# Altium project VCU 3.0.PrjPcb
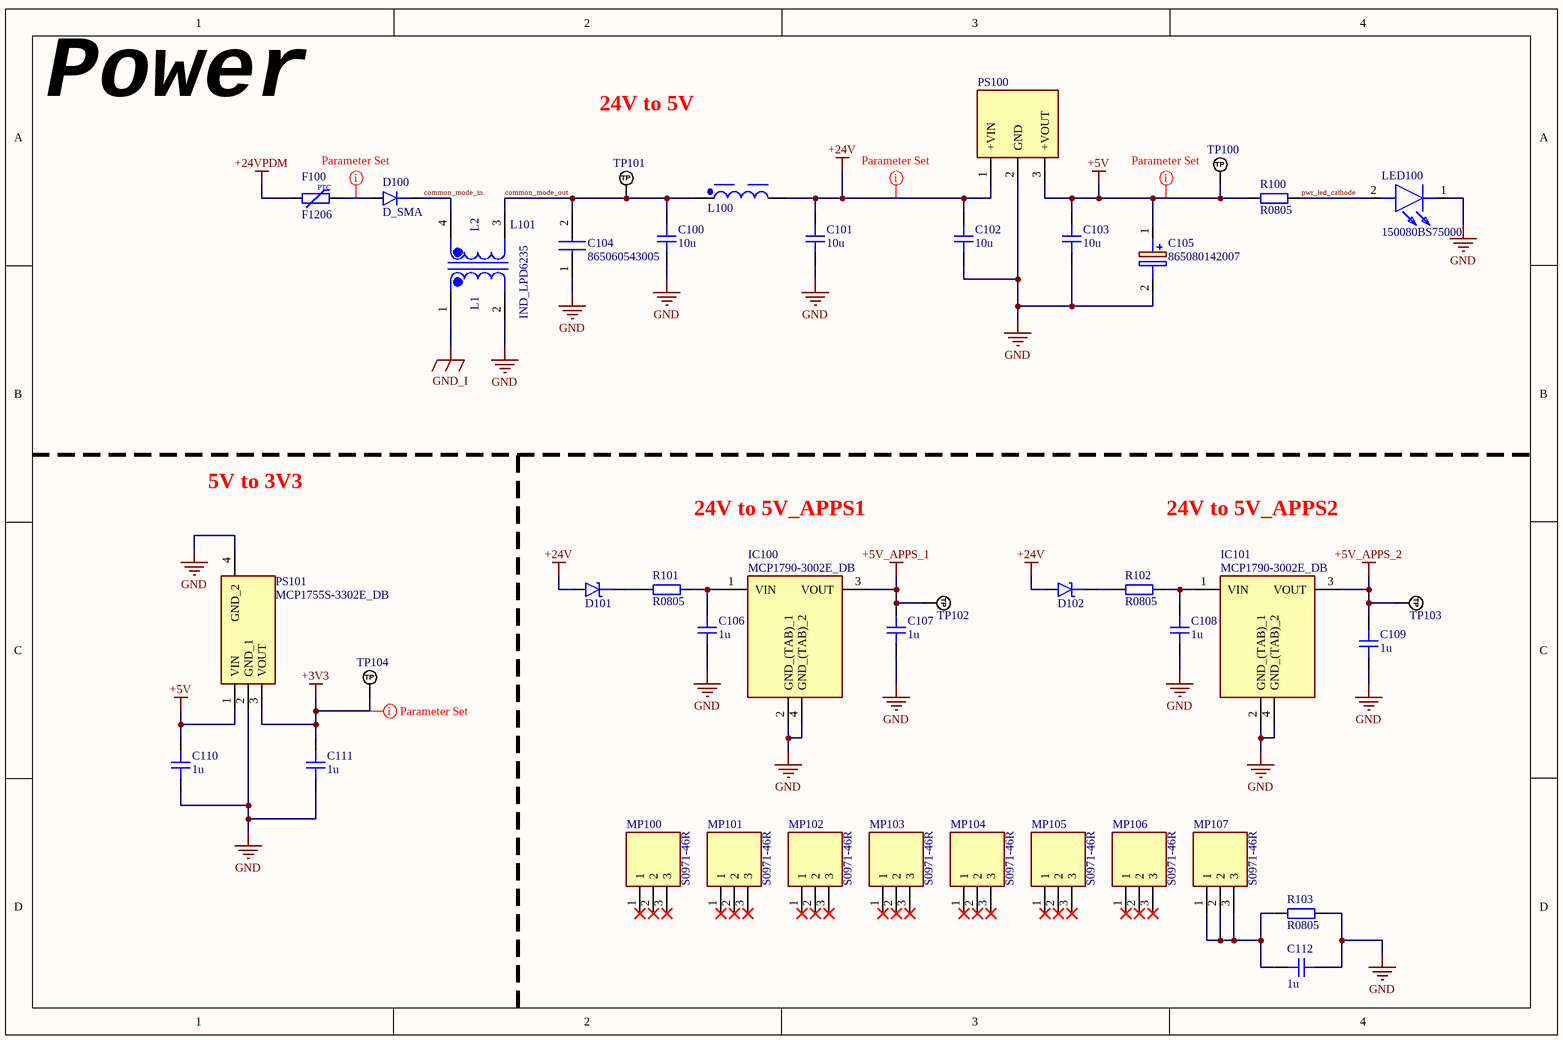
[diagram p0: POWER.SchDoc]
6 sheets, 199 parts. Net scope: global (net labels, ports and power ports of the same name join across sheets).
Board file: PCB_VCU3.0.PcbDoc
Sheets:
  POWER.SchDoc
  PIC32.SchDoc
  CAN.SchDoc
  APPS.SchDoc
  OUTPUT.SchDoc
  MOSFETS.SchDoc

## Sheet POWER.SchDoc
size A4; SheetNumber: 1; SheetTotal: 6; SPICEModelCacheUVDKUZOY: <root> / <DocumentId>UVDKUZOY</DocumentId> / <CacheFrame Number="0"> / <Model Name="1280_74477005_5.6u" Kind="CKT"> / <Text>******* / .subckt 1280_74477005_5.6u 1 2 / Rp 1 2 5511 / Cp 1 2 8p / Rs 1 N3 0.0105 / L1 N3 2 5.464u / .ends 1280_74477005_5.6u</Text> / </Model> / </CacheFrame> / </root>

### Parts
C100  10u  [CAP_0805]
C101  10u  [CAP_0805]
C102  10u  [CAP_0805]
C103  10u  [CAP_0805]
C104  865060543005  [865060543005]
C105  865080142007  [CAPAE530X550N]
C106  1u  [CAP_0805]
C107  1u  [CAP_0805]
C108  1u  [CAP_0805]
C109  1u  [CAP_0805]
C110  1u  [CAP_0805]
C111  1u  [CAP_0805]
C112  1u  [CAP_0805]
D100  D_SMA  [DO-214AC-2 (SMA)]
D101  D_SCHOTTKY_SOD_323  [SOD-323]  (value not drawn)
D102  D_SCHOTTKY_SOD_323  [SOD-323]  (value not drawn)
F100  F1206  [FUSE_1206]
IC100  MCP1790-3002E_DB  [SOT230P700X180-4N]
IC101  MCP1790-3002E_DB  [SOT230P700X180-4N]
L100  5.6uH, 8.7A  [WE-PD_1280]  (value not drawn)
L101  IND_LPD6235  [IND_LPD6235]
LED100  150080BS75000  [LEDC2012X80N]
MP100  S0971-46R  [S097146R]
MP101  S0971-46R  [S097146R]
MP102  S0971-46R  [S097146R]
MP103  S0971-46R  [S097146R]
MP104  S0971-46R  [S097146R]
MP105  S0971-46R  [S097146R]
MP106  S0971-46R  [S097146R]
MP107  S0971-46R  [S097146R]
PS100  R-78E5.0-0.5  [R78E5005]  (value not drawn)
PS101  MCP1755S-3302E_DB  [SOT230P700X180-4N]
R100  R0805  [RES_0805]
R101  R0805  [RES_0805]
R102  R0805  [RES_0805]
R103  R0805  [RES_0805]
TP100  TP_NOBOM  [PAD_RND_1MM]  (value not drawn)  (no BOM)
TP101  TP_NOBOM  [PAD_RND_1MM]  (value not drawn)  (no BOM)
TP102  TP_NOBOM  [PAD_RND_1MM]  (value not drawn)  (no BOM)
TP103  TP_NOBOM  [PAD_RND_1MM]  (value not drawn)  (no BOM)
TP104  TP_NOBOM  [PAD_RND_1MM]  (value not drawn)  (no BOM)

### Nets
+3V3: C111.1 PS101.3(VOUT) TP104.1(TP)
+5V: C103.2 C105.1(+) C110.1 PS100.3(+VOUT) PS101.1(VIN) R100.1 TP100.1(TP)
+5V_APPS_1: C107.1 IC100.3(VOUT) TP102.1(TP)
+5V_APPS_2: C109.1 IC101.3(VOUT) TP103.1(TP)
+24V: C101.2 C102.2 D101.A D102.A L100.2 PS100.1(+VIN)
+24VPDM: F100.1
GND: C100.1 C101.1 C102.1 C103.1 C104.1(+) C105.2(-) C106.2 C107.2 C108.2 C109.2 C110.2 C111.2 C112.2 IC100.2(GND_(TAB)_1) IC100.4(GND_(TAB)_2) IC101.2(GND_(TAB)_1) IC101.4(GND_(TAB)_2) L101.2 LED100.1(K) PS100.2(GND) PS101.2(GND_1) PS101.4(GND_2) R103.1
GND_I: L101.1
common_mode_in: D100.K L101.4
common_mode_out: C100.2 C104.2(-) L100.1 L101.3 TP101.1(TP)
pwr_led_cathode: LED100.2(A) R100.2
NetC106_1: C106.1 IC100.1(VIN) R101.1
NetC108_1: C108.1 IC101.1(VIN) R102.1
NetC112_1: C112.1 MP107.1 MP107.2 MP107.3 R103.2
NetD100_A: D100.A F100.2
NetD101_K: D101.K R101.2
NetD102_K: D102.K R102.2

Not connected (* = marked no-connect by the designer): MP100 1* 2* 3*; MP101 1* 2* 3*; MP102 1* 2* 3*; MP103 1* 2* 3*; MP104 1* 2* 3*; MP105 1* 2* 3*; MP106 1* 2* 3*

### Layout directives
net class POWER: +3V3, +5V, +24V, NetD100_A

### Notes on the sheet
- Power
- 24V to 5V
- 5V to 3V3
- 24V to 5V_APPS1
- 24V to 5V_APPS2
- (in symbol FUSE_PPTC_1206) PTC
- (in symbol IND_LPD6235) L2; L1

### Library data of the parts
C100-C103 C106-C112 = CAP_0805_10V: Capacitor SMD 0805 10V
C104 = 865060543005: Capacitor; Manufacturer_Name: Wurth Elektronik; Datasheet Link: https://componentsearchengine.com/Datasheets/1/865060543005.pdf; Height: 5.5mm; Manufacturer_Part_Number: 865060543005; Mouser Part Number: 710-865060543005; Mouser Price/Stock: https://www.mouser.co.uk/ProductDetail/Wurth-Elektronik/865060543005?qs=0KOYDY2FL29pKd1yRWsrOw%3D%3D
C105 = 865080142007: Capacitor Polarised; Manufacturer_Name: Wurth Elektronik; Datasheet Link: https://katalog.we-online.com/pbs/datasheet/865080142007.pdf; Height: 5.5mm; Manufacturer_Part_Number: 865080142007; Mouser Part Number: 710-865080142007; Mouser Price/Stock: https://www.mouser.co.uk/ProductDetail/Wurth-Elektronik/865080142007?qs=0KOYDY2FL2%2Fwso3YmuIP2w%3D%3D
D100 = D_SMA: Diode SMD SMA (DO-214AA)
D101 D102 = D_SCHOTTKY_SOD_323: Diode Schottky SMD SOD-323
F100 = FUSE_PPTC_1206: Fuse PPTC SMD 1206; Manufacturer: *; Manufacturer Part Number: *
IC100 IC101 = MCP1790-3002E_DB: Integrated Circuit; Manufacturer_Name: Microchip; Manufacturer_Part_Number: MCP1790-3002E/DB; Datasheet Link: http://ww1.microchip.com/downloads/en/DeviceDoc/22075b.pdf; Height: 1.8mm; Mouser Part Number: 579-MCP1790-3002E/DB; Mouser Price/Stock: https://www.mouser.co.uk/ProductDetail/Microchip-Technology/MCP1790-3002E-DB?qs=gsqZ4L1luKroJ%252BBibcYbpw%3D%3D; Arrow Part Number: MCP1790-3002E/DB; Arrow Price/Stock: https://www.arrow.com/en/products/mcp1790-3002edb/microchip-technology?region=nac
L100 = 74477005: WE-PD SMT Power Inductor, size 1280, 5.6uH, 8.7A, 13.5mOhm; Manufacturer: Wurth Elektronik; Case/Size Code: 1280; DC Resistance: 10.5mOhm; Saturation Current: 10A; Self Resonant Frequency: 24MHz; Type: Standard; Manufacturer Part Number: 74477005; Category: Power Inductors; Match Code: WE-PD; ComponentLink1Description: Website Link; ComponentLink1URL: https://www.we-online.com/redexpert/article/74477005?ad; ComponentLink2Description: Datasheet Link; ComponentLink2URL: https://www.we-online.com/redexpert/spec/74477005?ad; Mount: Surface Mount; Operating Temperature Max: 125°C; Operating Temperature Min: -40°C; Packaging: Tape and Reel; Length: 12mm; Width: 12mm; Height: 8mm; DC Resistance Max: 13.5mOhm; Inductance: 5.6uH; Rated Current: 8.7A
LED100 = 150080BS75000: LED; Manufacturer_Name: Wurth Elektronik; Datasheet Link: https://katalog.we-online.com/led/datasheet/150080BS75000.pdf; Height: 0.8mm; Manufacturer_Part_Number: 150080BS75000; Mouser Part Number: 710-150080BS75000; Mouser Price/Stock: https://www.mouser.co.uk/ProductDetail/Wurth-Elektronik/150080BS75000?qs=2kOmHSv6VfT2tBo3UPVqAQ%3D%3D
MP100-MP107 = S0971-46R: Mechanical Part; Manufacturer_Name: Harwin; Datasheet Link: https://cdn.harwin.com/pdfs/S0971-46R.pdf; Height: 2.1mm; Manufacturer_Part_Number: S0971-46R; Mouser Part Number: 855-S0971-46R; Mouser Price/Stock: https://www.mouser.co.uk/ProductDetail/Harwin/S0971-46R?qs=AXRVZpzixL%252Bly5Y74siI1Q%3D%3D
PS100 = R-78E5.0-0.5: Power Supply; Manufacturer_Name: RECOM Power; Datasheet Link: https://datasheet.datasheetarchive.com/originals/distributors/Datasheets_SAMA/1560217c2d38d5ce10907af13420fc49.pdf; Height: 10.9mm; Manufacturer_Part_Number: R-78E5.0-0.5; Mouser Part Number: 919-R-78E5.0-0.5; Mouser Price/Stock: https://www.mouser.co.uk/ProductDetail/RECOM-Power/R-78E5.0-0.5?qs=JeAkOuORR2UvBuiB2kZVZQ%3D%3D; Arrow Part Number: R-78E5.0-0.5; Arrow Price/Stock: https://www.arrow.com/en/products/r-78e5.0-0.5/recom-power?region=europe
PS101 = MCP1755S-3302E_DB: Power Supply; Manufacturer_Name: Microchip; Manufacturer_Part_Number: MCP1755S-3302E/DB; Datasheet Link: http://www.farnell.com/datasheets/1697992.pdf; Height: 1.8mm; Mouser Part Number: 579-MCP1755S-3302EDB; Mouser Price/Stock: https://www.mouser.co.uk/ProductDetail/Microchip-Technology/MCP1755S-3302E-DB?qs=OCR3PNzn1cc7Hxpx9CIZgA%3D%3D; Arrow Part Number: MCP1755S-3302E/DB; Arrow Price/Stock: https://www.arrow.com/en/products/mcp1755s-3302edb/microchip-technology?region=nac
R100-R103 = RES_0805: Resistor SMD 0805; Manufacturer: *; Manufacturer Part Number: *; Distributor Link: *; LCSC: *
TP100-TP104 = TEST_POINT_RND_1MM: Test Point Round 1mm (NO BOM)

## Sheet PIC32.SchDoc
size A2; SheetNumber: 2; SheetTotal: 6
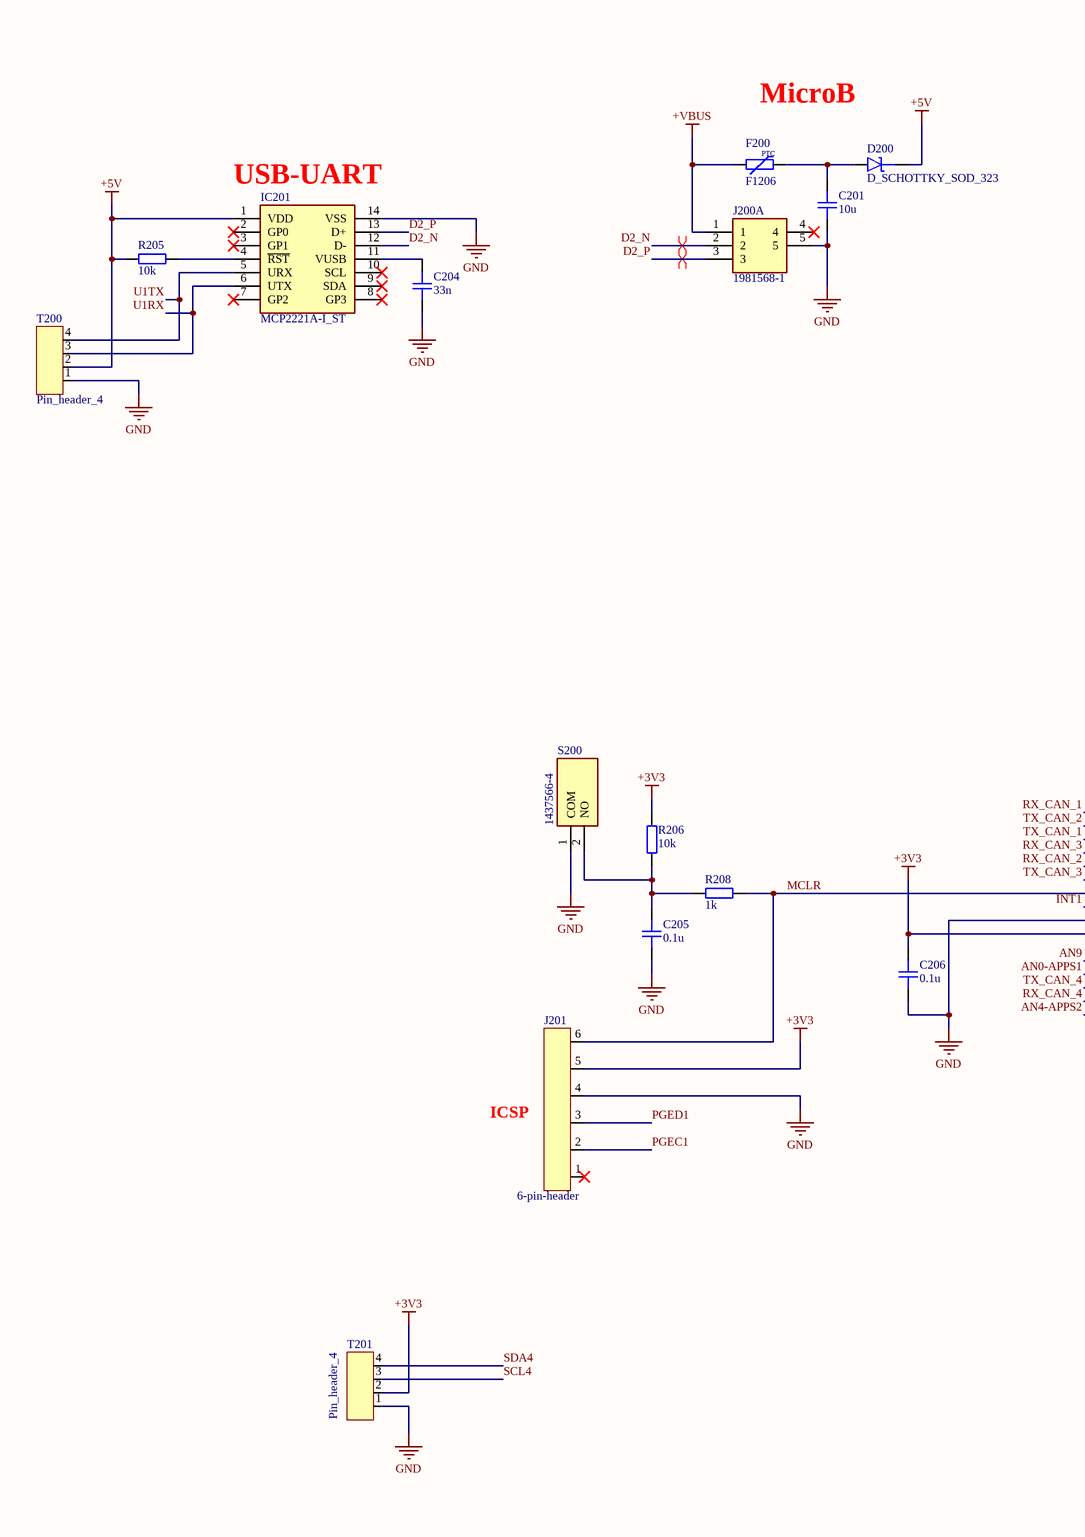
[diagram p1: PIC32.SchDoc, left]
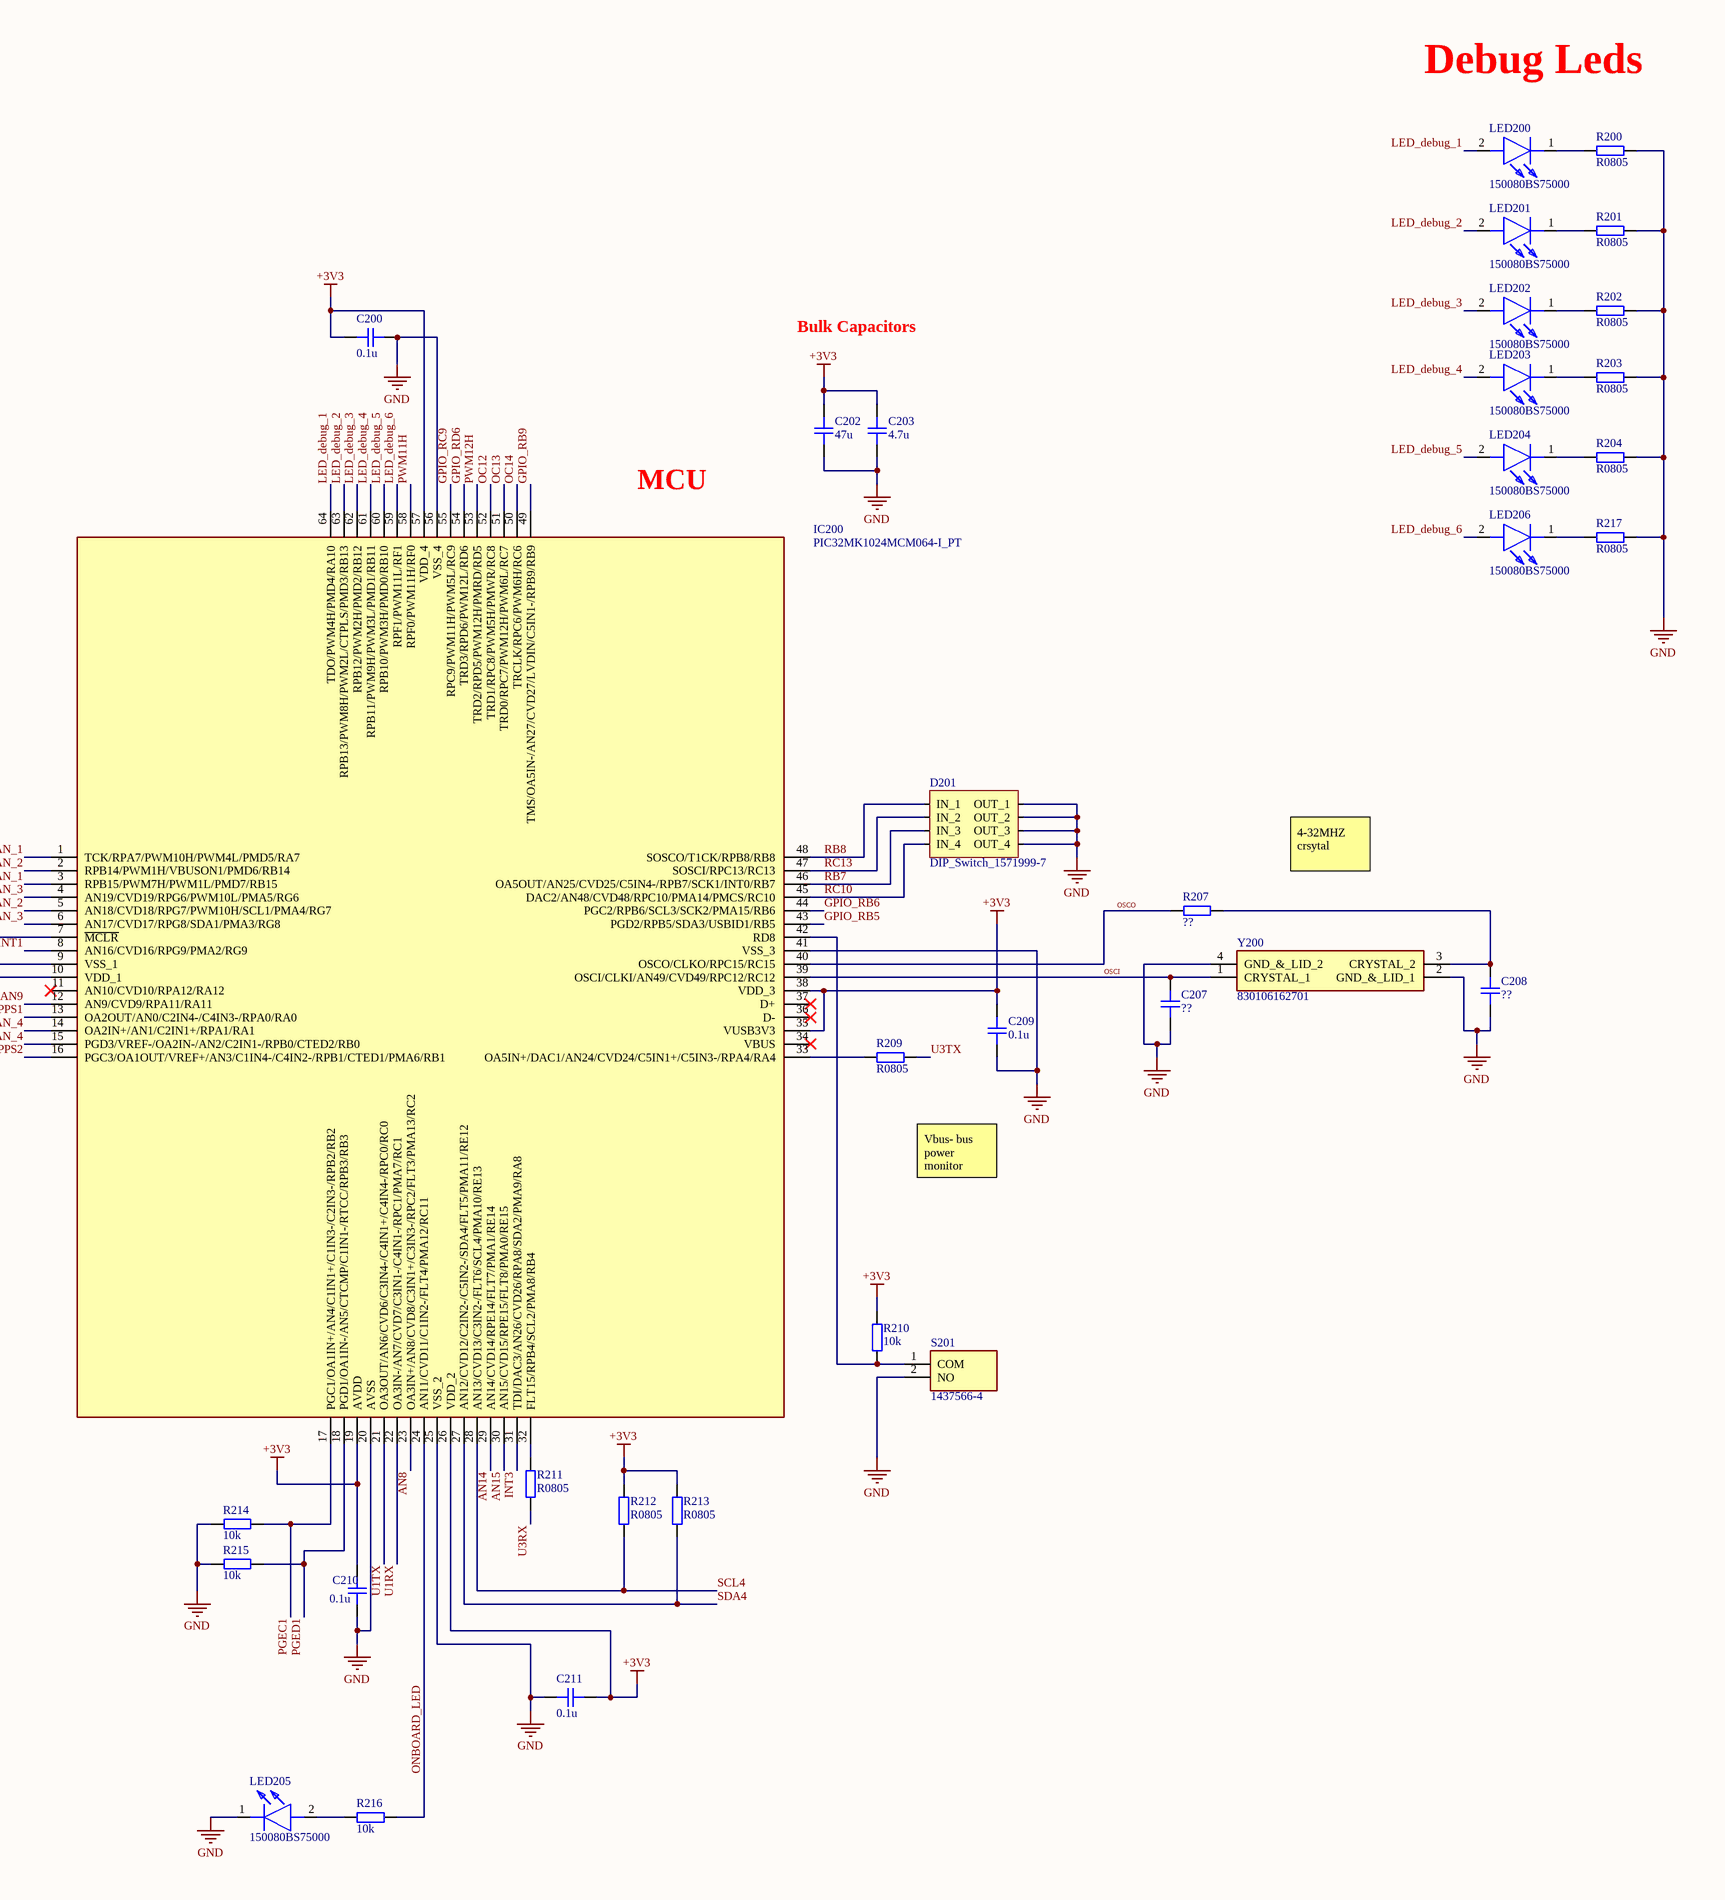
[diagram p2: PIC32.SchDoc, right]

### Parts
C200  0.1u  [CAP_0805]
C201  10u  [CAP_0805]
C202  47u  [CAP_0805]
C203  4.7u  [CAP_0805]
C204  33n  [CAP_0805]
C205  0.1u  [CAP_0805]
C206  0.1u  [CAP_0805]
C207  ??  [CAP_0805]
C208  ??  [CAP_0805]
C209  0.1u  [CAP_0805]
C210  0.1u  [CAP_0805]
C211  0.1u  [CAP_0805]
D200  D_SCHOTTKY_SOD_323  [SOD-323]
D201  DIP_Switch_1571999-7  [DIP_Switch_1571999-7 - duplicate]
F200  F1206  [FUSE_1206]
IC200  PIC32MK1024MCM064-I_PT  [QFP50P1200X1200X120-64N]
IC201  MCP2221A-I_ST  [SOP65P640X120-14N]
J200  1981568-1  [1981568-1]  (part A of 4)
J201  6-pin-header  [G800W302018EU]
LED200  150080BS75000  [LEDC2012X80N]
LED201  150080BS75000  [LEDC2012X80N]
LED202  150080BS75000  [LEDC2012X80N]
LED203  150080BS75000  [LEDC2012X80N]
LED204  150080BS75000  [LEDC2012X80N]
LED205  150080BS75000  [LEDC2012X80N]
LED206  150080BS75000  [LEDC2012X80N]
R200  R0805  [RES_0805]
R201  R0805  [RES_0805]
R202  R0805  [RES_0805]
R203  R0805  [RES_0805]
R204  R0805  [RES_0805]
R205  10k  [RES_0805]
R206  10k  [RES_0805]
R207  ??  [RES_0805]
R208  1k  [RES_0805]
R209  R0805  [RES_0805]
R210  10k  [RES_0805]
R211  R0805  [RES_0805]
R212  R0805  [RES_0805]
R213  R0805  [RES_0805]
R214  10k  [RES_0805]
R215  10k  [RES_0805]
R216  10k  [RES_0805]
R217  R0805  [RES_0805]
S200  1437566-4  [14375664]
S201  1437566-4  [14375664]
T200  Pin_header_4  [Pin_header_4]
T201  Pin_header_4  [Pin_header_4]
Y200  830106162701  [830106162701]

### Nets
+3V3: C200.1 C202.1 C203.1 C206.2 C209.1 C210.2 C211.1 IC200.10(VDD_1) IC200.19(AVDD) IC200.26(VDD_2) IC200.35(VUSB3V3) IC200.38(VDD_3) IC200.57(VDD_4) J201.5 R206.1 R210.2 R212.1 R213.1 T201.2
+5V: D200.K IC201.1(VDD) R205.1 T200.2
+VBUS: F200.1 J200.1
GND: C200.2 C201.2 C202.2 C203.2 C204.1 C205.1 C206.1 C207.1 C208.1 C209.2 C210.1 C211.2 D201.5(OUT_4) D201.6(OUT_3) D201.7(OUT_2) D201.8(OUT_1) IC200.9(VSS_1) IC200.20(AVSS) IC200.25(VSS_2) IC200.41(VSS_3) IC200.56(VSS_4) IC201.14(VSS) J200.5 J201.4 LED205.1(K) R200.1 R201.1 R202.1 R203.1 R204.1 R214.2 R215.2 R217.1 S200.1(COM) S201.2(NO) T200.1 T201.1 Y200.2(GND_&_LID_1) Y200.4(GND_&_LID_2)
AN0-APPS1: IC200.13(OA2OUT/AN0/C2IN4-/C4IN3-/RPA0/RA0)
AN4-APPS2: IC200.16(PGC3/OA1OUT/VREF+/AN3/C1IN4-/C4IN2-/RPB1/CTED1/PMA6/RB1)
AN8: IC200.23(OA3IN+/AN8/CVD8/C3IN1+/C3IN3-/RPC2/FLT3/PMA13/RC2)
AN9: IC200.12(AN9/CVD9/RPA11/RA11)
AN14: IC200.29(AN14/CVD14/RPE14/FLT7/PMA1/RE14)
AN15: IC200.30(AN15/CVD15/RPE15/FLT8/PMA0/RE15)
D2_N: IC201.12(D-) J200.2
D2_P: IC201.13(D+) J200.3
GPIO_RB5: IC200.43(PGD2/RPB5/SDA3/USBID1/RB5)
GPIO_RB6: IC200.44(PGC2/RPB6/SCL3/SCK2/PMA15/RB6)
GPIO_RB9: IC200.49(TMS/OA5IN-/AN27/CVD27/LVDIN/C5IN1-/RPB9/RB9)
GPIO_RC9: IC200.55(RPC9/PWM11H/PWM5L/RC9)
GPIO_RD6: IC200.54(TRD3/RPD6/PWM12L/RD6)
INT1: IC200.8(AN16/CVD16/RPG9/PMA2/RG9)
INT3: IC200.31(TDI/DAC3/AN26/CVD26/RPA8/SDA2/PMA9/RA8)
LED_debug_1: IC200.64(TDO/PWM4H/PMD4/RA10) LED200.2(A)
LED_debug_2: IC200.63(RPB13/PWM8H/PWM2L/CTPLS/PMD3/RB13) LED201.2(A)
LED_debug_3: IC200.62(RPB12/PWM2H/PMD2/RB12) LED202.2(A)
LED_debug_4: IC200.61(RPB11/PWM9H/PWM3L/PMD1/RB11) LED203.2(A)
LED_debug_5: IC200.60(RPB10/PWM3H/PMD0/RB10) LED204.2(A)
LED_debug_6: IC200.59(RPF1/PWM11L/RF1) LED206.2(A)
MCLR: IC200.7(~{MCLR}) J201.6 R208.1
OC12: IC200.52(TRD1/RPC8/PWM5H/PMWR/RC8)
OC13: IC200.51(TRD0/RPC7/PWM12H/PWM6L/RC7)
OC14: IC200.50(TRCLK/RPC6/PWM6H/RC6)
ONBOARD_LED: IC200.24(AN11/CVD11/C1IN2-/FLT4/PMA12/RC11) R216.1
OSCI: C207.2 IC200.39(OSCI/CLKI/AN49/CVD49/RPC12/RC12) Y200.1(CRYSTAL_1)
OSCO: IC200.40(OSCO/CLKO/RPC15/RC15) R207.2
PGEC1: IC200.17(PGC1/OA1IN+/AN4/C1IN1+/C1IN3-/C2IN3-/RPB2/RB2) J201.2 R214.1
PGED1: IC200.18(PGD1/OA1IN-/AN5/CTCMP/C1IN1-/RTCC/RPB3/RB3) J201.3 R215.1
PWM11H: IC200.58(RPF0/PWM11H/RF0)
PWM12H: IC200.53(TRD2/RPD5/PWM12H/PMRD/RD5)
RB7: D201.3(IN_3) IC200.46(OA5OUT/AN25/CVD25/C5IN4-/RPB7/SCK1/INT0/RB7)
RB8: D201.1(IN_1) IC200.48(SOSCO/T1CK/RPB8/RB8)
RC10: D201.4(IN_4) IC200.45(DAC2/AN48/CVD48/RPC10/PMA14/PMCS/RC10)
RC13: D201.2(IN_2) IC200.47(SOSCI/RPC13/RC13)
RX_CAN_1: IC200.1(TCK/RPA7/PWM10H/PWM4L/PMD5/RA7)
RX_CAN_2: IC200.5(AN18/CVD18/RPG7/PWM10H/SCL1/PMA4/RG7)
RX_CAN_3: IC200.4(AN19/CVD19/RPG6/PWM10L/PMA5/RG6)
RX_CAN_4: IC200.15(PGD3/VREF-/OA2IN-/AN2/C2IN1-/RPB0/CTED2/RB0)
SCL4: IC200.28(AN13/CVD13/C3IN2-/FLT6/SCL4/PMA10/RE13) R212.2 T201.3
SDA4: IC200.27(AN12/CVD12/C2IN2-/C5IN2-/SDA4/FLT5/PMA11/RE12) R213.2 T201.4
TX_CAN_1: IC200.3(RPB15/PWM7H/PWM1L/PMD7/RB15)
TX_CAN_2: IC200.2(RPB14/PWM1H/VBUSON1/PMD6/RB14)
TX_CAN_3: IC200.6(AN17/CVD17/RPG8/SDA1/PMA3/RG8)
TX_CAN_4: IC200.14(OA2IN+/AN1/C2IN1+/RPA1/RA1)
U1RX: IC200.22(OA3IN-/AN7/CVD7/C3IN1-/C4IN1-/RPC1/PMA7/RC1) IC201.6(UTX) T200.3
U1TX: IC200.21(OA3OUT/AN6/CVD6/C3IN4-/C4IN1+/C4IN4-/RPC0/RC0) IC201.5(URX) T200.4
U3RX: R211.2
U3TX: R209.2
NetC201_1: C201.1 D200.A F200.2
NetC204_2: C204.2 IC201.11(VUSB)
NetC205_2: C205.2 R206.2 R208.2 S200.2(NO)
NetC208_2: C208.2 R207.1 Y200.3(CRYSTAL_2)
NetIC200_32: IC200.32(FLT15/RPB4/SCL2/PMA8/RB4) R211.1
NetIC200_33: IC200.33(OA5IN+/DAC1/AN24/CVD24/C5IN1+/C5IN3-/RPA4/RA4) R209.1
NetIC200_42: IC200.42(RD8) R210.1 S201.1(COM)
NetIC201_4: IC201.4(~{RST}) R205.2
NetLED200_1: LED200.1(K) R200.2
NetLED201_1: LED201.1(K) R201.2
NetLED202_1: LED202.1(K) R202.2
NetLED203_1: LED203.1(K) R203.2
NetLED204_1: LED204.1(K) R204.2
NetLED205_2: LED205.2(A) R216.2
NetLED206_1: LED206.1(K) R217.2

Not connected (* = marked no-connect by the designer): IC200 11(AN10/CVD10/RPA12/RA12)* 34(VBUS)* 36(D-)* 37(D+)*; IC201 2(GP0)* 3(GP1)* 7(GP2)* 8(GP3)* 9(SDA)* 10(SCL)*; J200 4*; J201 1*

### Layout directives
differential pair; net class DIFF_USB: D2_N, D2_P

### Notes on the sheet
- Debug Leds
- MicroB
- (near IC201) USB-UART
- Bulk Capacitors
- (near IC200) MCU
- 4-32MHZ crsytal
- (near J201) ICSP
- Vbus- bus power monitor
- (in symbol FUSE_PPTC_1206) PTC

### Library data of the parts
C200 C202 C203 C205-C211 = CAP_0805_16V: Capacitor SMD 0805 16V
C201 C204 = CAP_0805_10V: Capacitor SMD 0805 10V
D200 = D_SCHOTTKY_SOD_323: Diode Schottky SMD SOD-323
F200 = FUSE_PPTC_1206: Fuse PPTC SMD 1206; Manufacturer: *; Manufacturer Part Number: *
IC200 = PIC32MK1024MCM064-I_PT: Integrated Circuit; Manufacturer_Name: Microchip; Manufacturer_Part_Number: PIC32MK1024MCM064-I/PT; Datasheet Link: https://ww1.microchip.com/downloads/aemDocuments/documents/MCU32/ProductDocuments/DataSheets/PIC32MK-GPK-MCM-with-CAN-FD-Family-DataSheet-DS60001519E.pdf; Height: 1.2mm; Mouser Part Number: 579-2MK1024MCM064IPT; Mouser Price/Stock: https://www.mouser.co.uk/ProductDetail/Microchip-Technology/PIC32MK1024MCM064-I-PT?qs=W%2FMpXkg%252BdQ4dBI32NJdQMg%3D%3D; Arrow Part Number: PIC32MK1024MCM064-I/PT; Arrow Price/Stock: https://www.arrow.com/en/products/pic32mk1024mcm064-ipt/microchip-technology?region=nac
IC201 = MCP2221A-I_ST: Integrated Circuit; Manufacturer_Name: Microchip; Manufacturer_Part_Number: MCP2221A-I/ST; Datasheet Link: http://ww1.microchip.com/downloads/en/devicedoc/20005565b.pdf; Height: 1.2mm; Mouser Part Number: 579-MCP2221A-I/ST; Mouser Price/Stock: https://www.mouser.co.uk/ProductDetail/Microchip-Technology/MCP2221A-I-ST?qs=ZEMkBHnybREMkqMgzOrcGQ%3D%3D; Arrow Part Number: MCP2221A-I/ST; Arrow Price/Stock: https://www.arrow.com/en/products/mcp2221a-ist/microchip-technology?region=nac
J200 = 1981568-1: Connector; Manufacturer_Name: TE Connectivity; Datasheet Link: http://www.te.com/commerce/DocumentDelivery/DDEController?Action=srchrtrv&DocNm=1981568&DocType=Customer+Drawing&DocLang=English; Manufacturer_Part_Number: 1981568-1; Mouser Part Number: 571-1981568-1; Mouser Price/Stock: https://www.mouser.co.uk/ProductDetail/TE-Connectivity/1981568-1?qs=zxTme0yW%2FbaAfvOKTKC5hw%3D%3D; Arrow Part Number: 1981568-1; Arrow Price/Stock: https://www.arrow.com/en/products/1981568-1/te-connectivity?region=europe
J201 = G800W302018EU: Pin Header 6 Position 2.54mm Pitch; Manufacturer: Amphenol; Manufacturer Part Number: G800W302018EU
LED200-LED206 = 150080BS75000: LED; Manufacturer_Name: Wurth Elektronik; Datasheet Link: https://katalog.we-online.com/led/datasheet/150080BS75000.pdf; Height: 0.8mm; Manufacturer_Part_Number: 150080BS75000; Mouser Part Number: 710-150080BS75000; Mouser Price/Stock: https://www.mouser.co.uk/ProductDetail/Wurth-Elektronik/150080BS75000?qs=2kOmHSv6VfT2tBo3UPVqAQ%3D%3D
R200-R217 = RES_0805: Resistor SMD 0805
  R200-R204 R209 R211-R213 R217: Manufacturer: *; Manufacturer Part Number: *; Distributor Link: *; LCSC: *
S200 S201 = 1437566-4: Switch; Manufacturer_Name: TE Connectivity; Datasheet Link: https://www.te.com/commerce/DocumentDelivery/DDEController?Action=showdoc&DocId=Customer+Drawing%7F1437566-3%7FC2%7Fpdf%7FEnglish%7FENG_CD_1437566-3_C7F14375662_1437566_3_1_c.dwg.pdf%-4; Height: 4.87mm; Manufacturer_Part_Number: 1437566-4; Mouser Part Number: N/A; Mouser Price/Stock: https://www.mouser.co.uk/ProductDetail/TE-Connectivity-Alcoswitch/1437566-4?qs=xoXDFGdkQ2nbcMrTmW1sHA%3D%3D; Arrow Part Number: 1437566-4; Arrow Price/Stock: https://www.arrow.com/en/products/1437566-4/te-connectivity?region=europe
Y200 = 830106162701: Crystal or Oscillator; Manufacturer_Name: Wurth Elektronik; Datasheet Link: https://www.we-online.com/components/products/datasheet/830106162701.pdf; Height: 1mm; Manufacturer_Part_Number: 830106162701; Mouser Part Number: 710-830106162701; Mouser Price/Stock: https://www.mouser.co.uk/ProductDetail/Wurth-Elektronik/830106162701?qs=hd1VzrDQEGiB2nVeND4SIw%3D%3D

## Sheet CAN.SchDoc
size A3; SheetNumber: 3; SheetTotal: 6
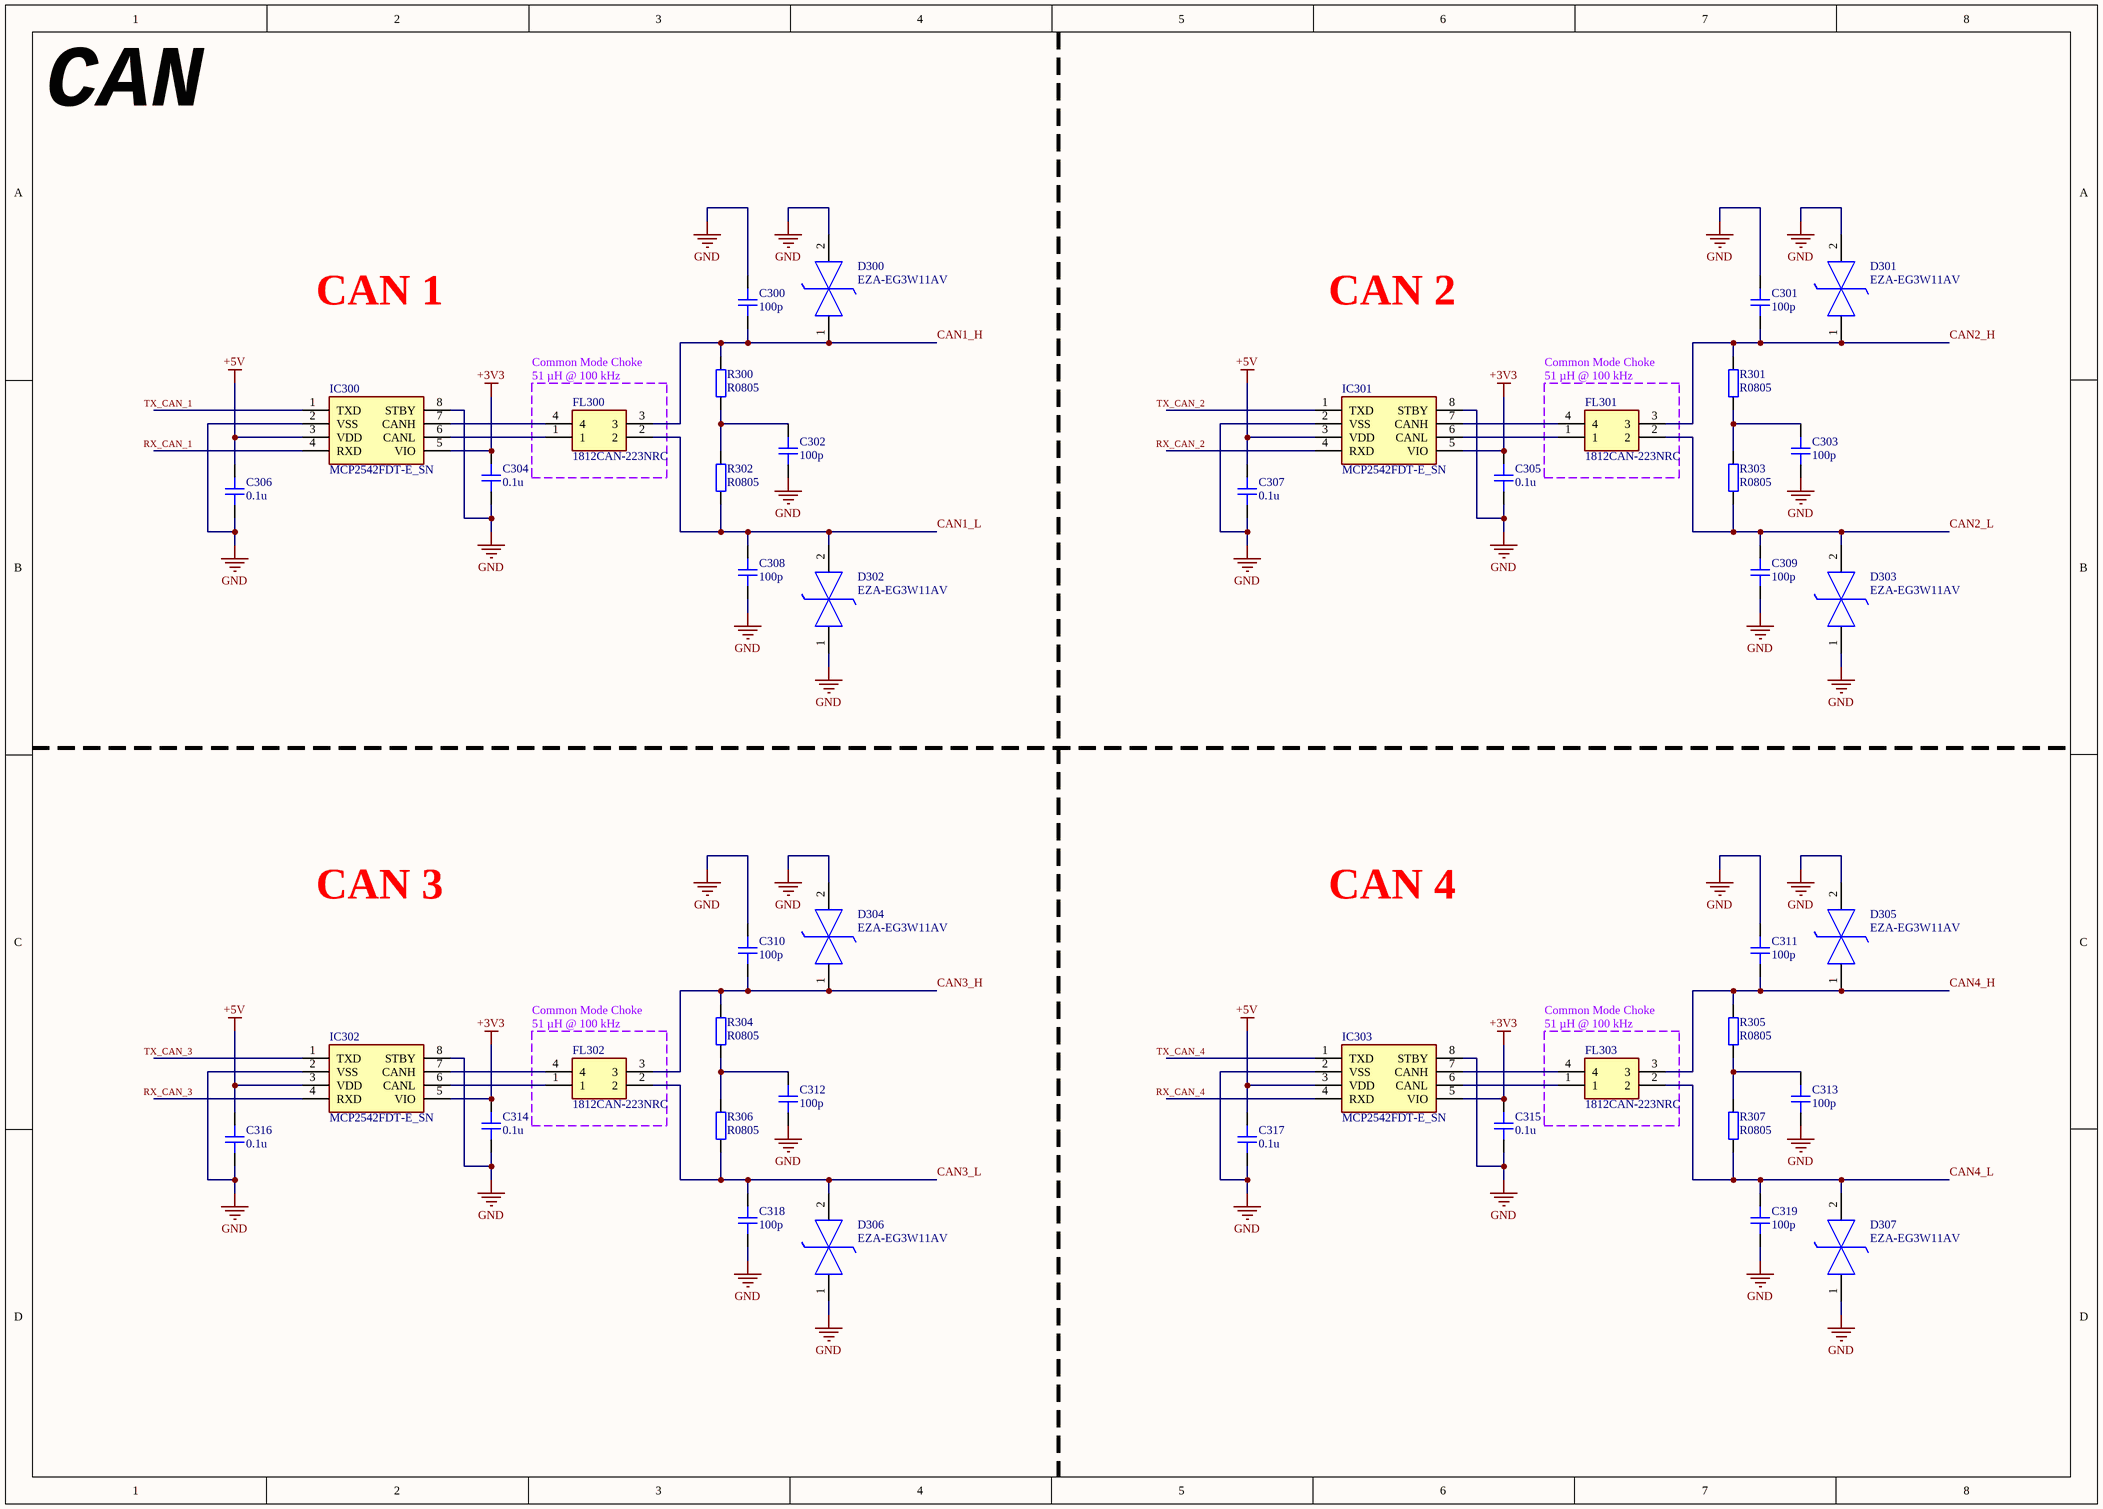
[diagram p3: CAN.SchDoc]

### Parts
C300  100p  [CAP_0805]
C301  100p  [CAP_0805]
C302  100p  [CAP_0805]
C303  100p  [CAP_0805]
C304  0.1u  [CAP_0805]
C305  0.1u  [CAP_0805]
C306  0.1u  [CAP_0805]
C307  0.1u  [CAP_0805]
C308  100p  [CAP_0805]
C309  100p  [CAP_0805]
C310  100p  [CAP_0805]
C311  100p  [CAP_0805]
C312  100p  [CAP_0805]
C313  100p  [CAP_0805]
C314  0.1u  [CAP_0805]
C315  0.1u  [CAP_0805]
C316  0.1u  [CAP_0805]
C317  0.1u  [CAP_0805]
C318  100p  [CAP_0805]
C319  100p  [CAP_0805]
D300  EZA-EG3W11AV  [EZAEG3W11AV]
D301  EZA-EG3W11AV  [EZAEG3W11AV]
D302  EZA-EG3W11AV  [EZAEG3W11AV]
D303  EZA-EG3W11AV  [EZAEG3W11AV]
D304  EZA-EG3W11AV  [EZAEG3W11AV]
D305  EZA-EG3W11AV  [EZAEG3W11AV]
D306  EZA-EG3W11AV  [EZAEG3W11AV]
D307  EZA-EG3W11AV  [EZAEG3W11AV]
FL300  1812CAN-223NRC  [1812CAN223NRC]
FL301  1812CAN-223NRC  [1812CAN223NRC]
FL302  1812CAN-223NRC  [1812CAN223NRC]
FL303  1812CAN-223NRC  [1812CAN223NRC]
IC300  MCP2542FDT-E_SN  [SOIC127P600X175-8N]
IC301  MCP2542FDT-E_SN  [SOIC127P600X175-8N]
IC302  MCP2542FDT-E_SN  [SOIC127P600X175-8N]
IC303  MCP2542FDT-E_SN  [SOIC127P600X175-8N]
R300  R0805  [RES_0805]
R301  R0805  [RES_0805]
R302  R0805  [RES_0805]
R303  R0805  [RES_0805]
R304  R0805  [RES_0805]
R305  R0805  [RES_0805]
R306  R0805  [RES_0805]
R307  R0805  [RES_0805]

### Nets
+3V3: C304.2 C305.2 C314.2 C315.2 IC300.5(VIO) IC301.5(VIO) IC302.5(VIO) IC303.5(VIO)
+5V: C306.2 C307.2 C316.2 C317.2 IC300.3(VDD) IC301.3(VDD) IC302.3(VDD) IC303.3(VDD)
GND: C300.1 C301.1 C302.2 C303.2 C304.1 C305.1 C306.1 C307.1 C308.2 C309.2 C310.1 C311.1 C312.2 C313.2 C314.1 C315.1 C316.1 C317.1 C318.2 C319.2 D300.2(K2) D301.2(K2) D302.1(K1) D303.1(K1) D304.2(K2) D305.2(K2) D306.1(K1) D307.1(K1) IC300.2(VSS) IC300.8(STBY) IC301.2(VSS) IC301.8(STBY) IC302.2(VSS) IC302.8(STBY) IC303.2(VSS) IC303.8(STBY)
CAN1_H: C300.2 D300.1(K1) FL300.3 R300.2
CAN1_L: C308.1 D302.2(K2) FL300.2 R302.1
CAN2_H: C301.2 D301.1(K1) FL301.3 R301.2
CAN2_L: C309.1 D303.2(K2) FL301.2 R303.1
CAN3_H: C310.2 D304.1(K1) FL302.3 R304.2
CAN3_L: C318.1 D306.2(K2) FL302.2 R306.1
CAN4_H: C311.2 D305.1(K1) FL303.3 R305.2
CAN4_L: C319.1 D307.2(K2) FL303.2 R307.1
RX_CAN_1: IC300.4(RXD)
RX_CAN_2: IC301.4(RXD)
RX_CAN_3: IC302.4(RXD)
RX_CAN_4: IC303.4(RXD)
TX_CAN_1: IC300.1(TXD)
TX_CAN_2: IC301.1(TXD)
TX_CAN_3: IC302.1(TXD)
TX_CAN_4: IC303.1(TXD)
NetC302_1: C302.1 R300.1 R302.2
NetC303_1: C303.1 R301.1 R303.2
NetC312_1: C312.1 R304.1 R306.2
NetC313_1: C313.1 R305.1 R307.2
NetFL300_1: FL300.1 IC300.6(CANL)
NetFL300_4: FL300.4 IC300.7(CANH)
NetFL301_1: FL301.1 IC301.6(CANL)
NetFL301_4: FL301.4 IC301.7(CANH)
NetFL302_1: FL302.1 IC302.6(CANL)
NetFL302_4: FL302.4 IC302.7(CANH)
NetFL303_1: FL303.1 IC303.6(CANL)
NetFL303_4: FL303.4 IC303.7(CANH)

### Notes on the sheet
- CAN
- CAN 1
- CAN 2
- (near FL300) Common Mode Choke
  51 µH @ 100 kHz
- (near FL301) Common Mode Choke
  51 µH @ 100 kHz
- CAN 3
- CAN 4
- (near FL302) Common Mode Choke
  51 µH @ 100 kHz
- (near FL303) Common Mode Choke
  51 µH @ 100 kHz

### Library data of the parts
C300-C319 = CAP_0805_10V: Capacitor SMD 0805 10V
D300-D307 = EZA-EG3W11AV: Diode ESD (Bi-directional); Manufacturer_Name: Panasonic; Datasheet Link: https://industrial.panasonic.com/cdbs/www-data/pdf/AWD0000/AWD0000C26.pdf; Height: 0.5mm; Manufacturer_Part_Number: EZA-EG3W11AV; Mouser Part Number: 667-EZA-EG3W11AV; Mouser Price/Stock: https://www.mouser.co.uk/ProductDetail/Panasonic/EZA-EG3W11AV?qs=0lSvoLzn4L%252BhlS%252B2lqbWqw%3D%3D; Arrow Part Number: EZA-EG3W11AV; Arrow Price/Stock: https://www.arrow.com/en/products/eza-eg3w11av/panasonic; Simulation Data: https://industrial.panasonic.com/content/data/CC/files/EZAEG3W11AV.zip
FL300-FL303 = 1812CAN-223NRC: Filter; Manufacturer_Name: COILCRAFT; Datasheet Link: https://www.coilcraft.com/getmedia/07970769-ca48-411d-9c96-6ae867bbb31e/1812can.pdf; Height: 3mm; Manufacturer_Part_Number: 1812CAN-223NRC; Mouser Part Number: 994-1812CAN-223NRC; Mouser Price/Stock: https://www.mouser.co.uk/ProductDetail/Coilcraft/1812CAN-223NRC?qs=wnTfsH77Xs58ULcmqHaGYA%3D%3D
IC300-IC303 = MCP2542FDT-E_SN: Integrated Circuit; Manufacturer_Name: Microchip; Manufacturer_Part_Number: MCP2542FDT-E/SN; Datasheet Link: https://ww1.microchip.com/downloads/en/DeviceDoc/MCP2542FD-MCP2542WFD-4WFD-Data-Sheet-DS20005514C.pdf; Height: 1.75mm; Mouser Part Number: 579-MCP2542FDT-E/SN; Mouser Price/Stock: https://www.mouser.co.uk/ProductDetail/Microchip-Technology-Atmel/MCP2542FDT-E-SN?qs=qdgZG5p0FZ7dgTYBMrlrQQ%3D%3D; Arrow Part Number: MCP2542FDT-E/SN; Arrow Price/Stock: https://www.arrow.com/en/products/mcp2542fdt-esn/microchip-technology?region=nac
R300-R307 = RES_0805: Resistor SMD 0805; Manufacturer: *; Manufacturer Part Number: *; Distributor Link: *; LCSC: *

## Sheet APPS.SchDoc
size A4; SheetNumber: 4; SheetTotal: 6
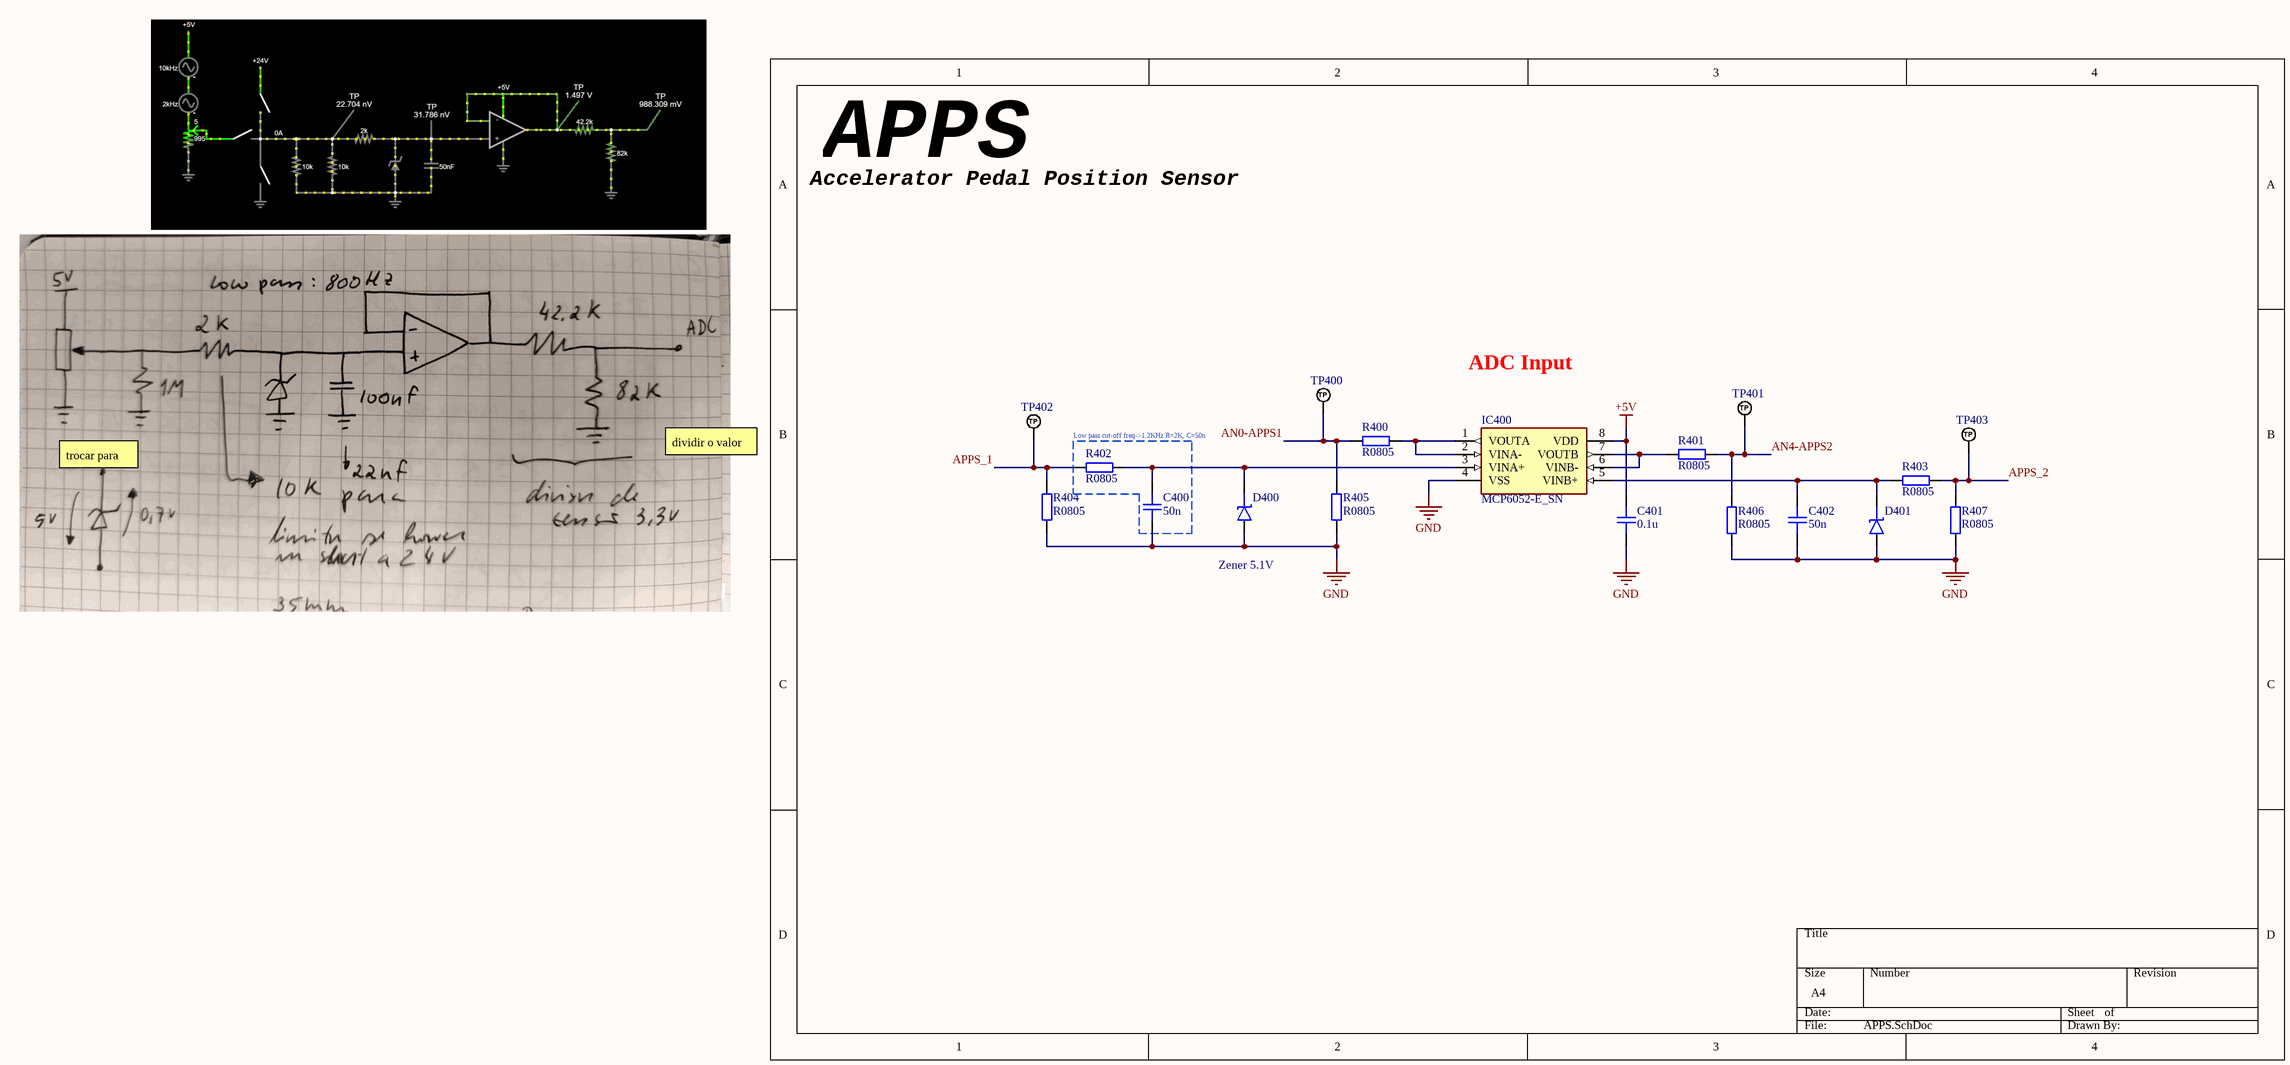
[diagram p4: APPS.SchDoc]

### Parts
C400  50n  [CAP_0805]
C401  0.1u  [CAP_0805]
C402  50n  [CAP_0805]
D400  D_SCHOTTKY_SOD_323  [SOD-323]  (value not drawn)
D401  D_SCHOTTKY_SOD_323  [SOD-323]  (value not drawn)
IC400  MCP6052-E_SN  [SOIC127P600X175-8N]
R400  R0805  [RES_0805]
R401  R0805  [RES_0805]
R402  R0805  [RES_0805]
R403  R0805  [RES_0805]
R404  R0805  [RES_0805]
R405  R0805  [RES_0805]
R406  R0805  [RES_0805]
R407  R0805  [RES_0805]
TP400  TP_NOBOM  [PAD_RND_1MM]  (value not drawn)  (no BOM)
TP401  TP_NOBOM  [PAD_RND_1MM]  (value not drawn)  (no BOM)
TP402  TP_NOBOM  [PAD_RND_1MM]  (value not drawn)  (no BOM)
TP403  TP_NOBOM  [PAD_RND_1MM]  (value not drawn)  (no BOM)

### Blocks framed on the sheet
Low pass cut-off freq->1.2KHz R=2K, C=50n: C400 R402

### Nets
+5V: C401.2 IC400.8(VDD)
GND: C400.2 C401.1 C402.2 D400.A D401.A IC400.4(VSS) R404.1 R405.2 R406.2 R407.1
AN0-APPS1: R400.2 R405.1 TP400.1(TP)
AN4-APPS2: R401.1 R406.1 TP401.1(TP)
APPS_1: R402.1 R404.2 TP402.1(TP)
APPS_2: R403.2 R407.2 TP403.1(TP)
NetC400_1: C400.1 D400.K IC400.3(VINA+) R402.2
NetC402_1: C402.1 D401.K IC400.5(VINB+) R403.1
NetIC400_1: IC400.1(VOUTA) IC400.2(VINA-) R400.1
NetIC400_6: IC400.6(VINB-) IC400.7(VOUTB) R401.2

### Notes on the sheet
- Accelerator Pedal Position Sensor
- APPS
- ADC Input
- trocar para 100k
- dividir o valor das resistencias por 10
- (near D400) Zener 5.1V

### Library data of the parts
C400-C402 = CAP_0805_10V: Capacitor SMD 0805 10V
D400 D401 = D_SCHOTTKY_SOD_323: Diode Schottky SMD SOD-323
IC400 = MCP6052-E_SN: Integrated Circuit; Manufacturer_Name: Microchip; Manufacturer_Part_Number: MCP6052-E/SN; Datasheet Link: http://ww1.microchip.com/downloads/en/DeviceDoc/MCP6051_DS22182B.pdf; Height: 1.75mm; Mouser Part Number: 579-MCP6052-E/SN; Mouser Price/Stock: https://www.mouser.com/Search/Refine.aspx?Keyword=579-MCP6052-E%2FSN
R400-R407 = RES_0805: Resistor SMD 0805; Manufacturer: *; Manufacturer Part Number: *; Distributor Link: *; LCSC: *
TP400-TP403 = TEST_POINT_RND_1MM: Test Point Round 1mm (NO BOM)

## Sheet OUTPUT.SchDoc
size A4; SheetNumber: 5; SheetTotal: 6
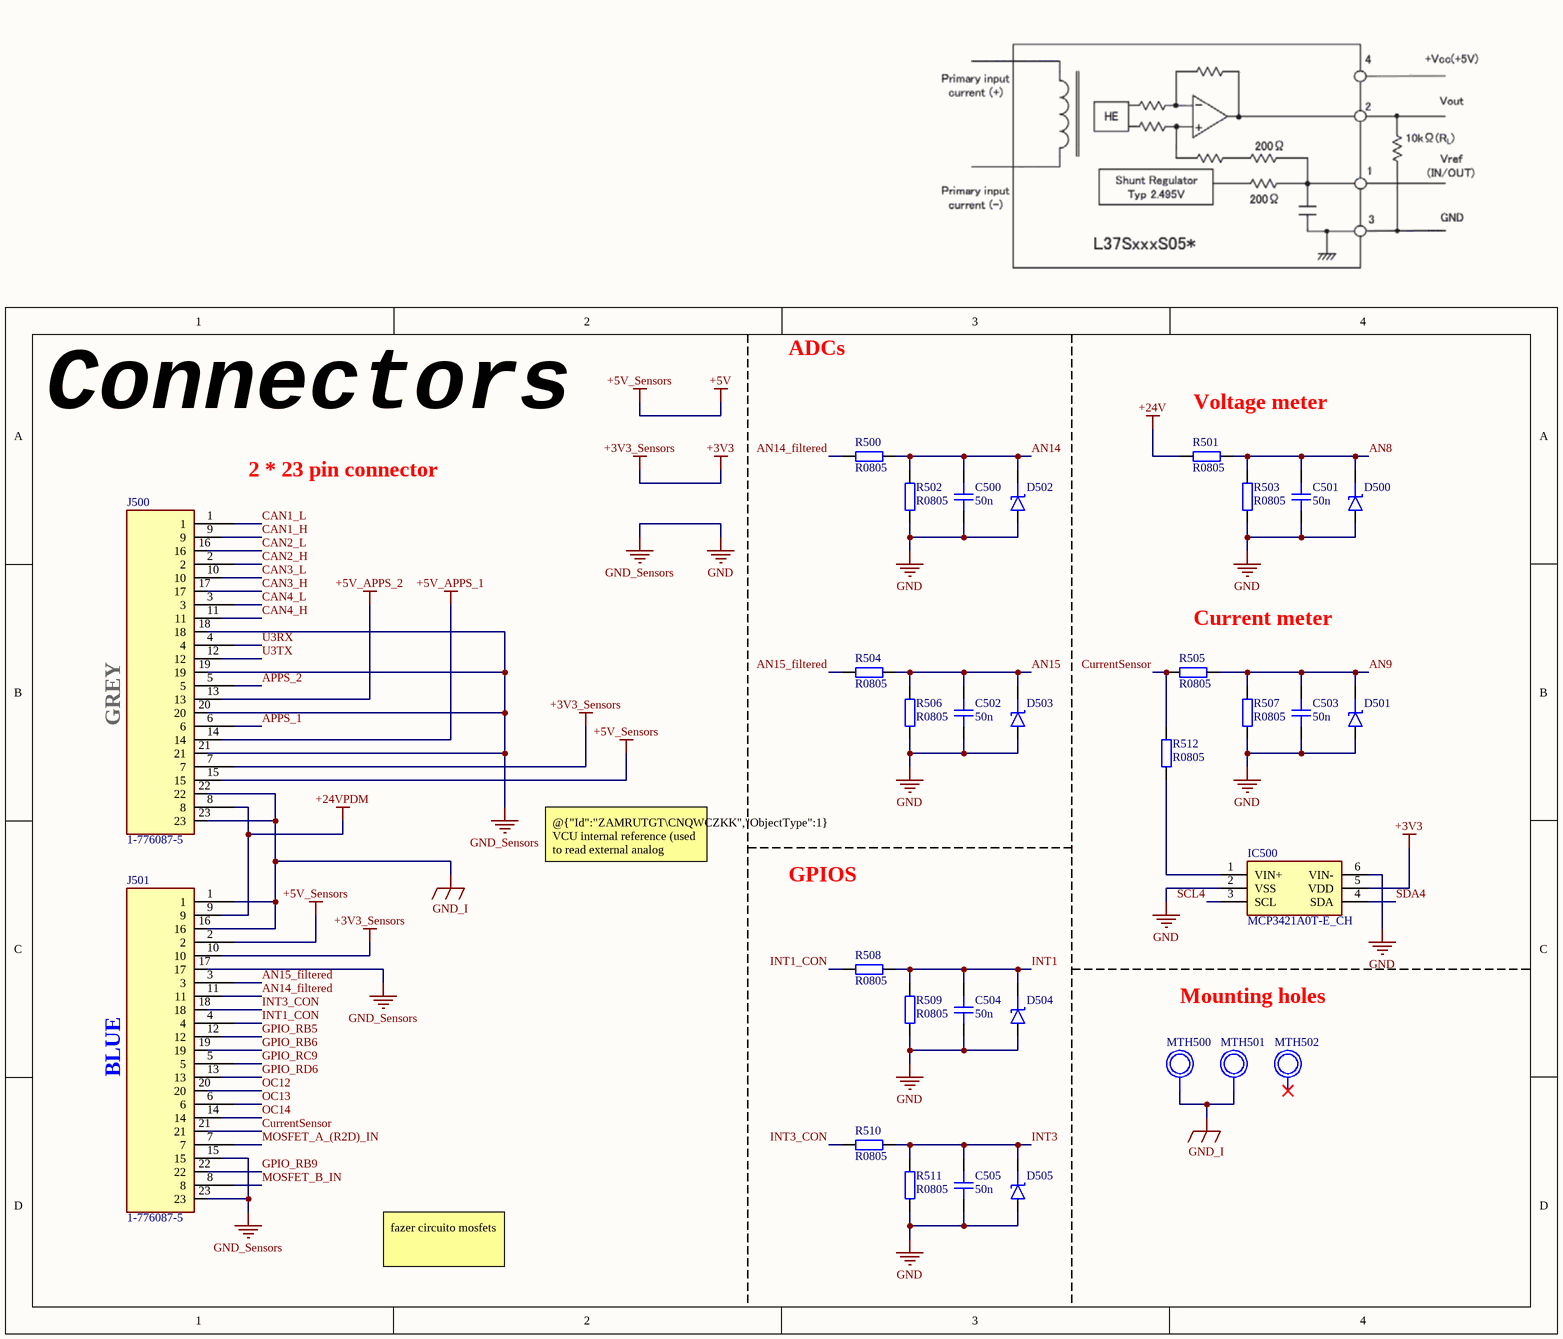
[diagram p5: OUTPUT.SchDoc]

### Parts
C500  50n  [CAP_0805]
C501  50n  [CAP_0805]
C502  50n  [CAP_0805]
C503  50n  [CAP_0805]
C504  50n  [CAP_0805]
C505  50n  [CAP_0805]
D500  D_SCHOTTKY_SOD_323  [SOD-323]  (value not drawn)
D501  D_SCHOTTKY_SOD_323  [SOD-323]  (value not drawn)
D502  D_SCHOTTKY_SOD_323  [SOD-323]  (value not drawn)
D503  D_SCHOTTKY_SOD_323  [SOD-323]  (value not drawn)
D504  D_SCHOTTKY_SOD_323  [SOD-323]  (value not drawn)
D505  D_SCHOTTKY_SOD_323  [SOD-323]  (value not drawn)
IC500  MCP3421A0T-E_CH  [SOT95P270X145-6N]
J500  1-776087-5  [1-776087-5]
J501  1-776087-5  [1-776087-5]
MTH500  Mounting_Hole_3.5mm  [Mounting_Hole_3.5mm]  (value not drawn)
MTH501  Mounting_Hole_3.5mm  [Mounting_Hole_3.5mm]  (value not drawn)
MTH502  Mounting_Hole_3.5mm  [Mounting_Hole_3.5mm]  (value not drawn)
R500  R0805  [RES_0805]
R501  R0805  [RES_0805]
R502  R0805  [RES_0805]
R503  R0805  [RES_0805]
R504  R0805  [RES_0805]
R505  R0805  [RES_0805]
R506  R0805  [RES_0805]
R507  R0805  [RES_0805]
R508  R0805  [RES_0805]
R509  R0805  [RES_0805]
R510  R0805  [RES_0805]
R511  R0805  [RES_0805]
R512  R0805  [RES_0805]

### Nets
+3V3: IC500.5(VDD) J500.7 J501.10  [also labelled +3V3_Sensors]
+5V: J500.15 J501.2  [also labelled +5V_Sensors]
+5V_APPS_1: J500.14
+5V_APPS_2: J500.13
+24V: R501.2
+24VPDM: J500.8 J501.9
GND: C500.2 C501.2 C502.2 C503.2 C504.2 C505.2 D500.A D501.A D502.A D503.A D504.A D505.A IC500.2(VSS) IC500.6(VIN-) J500.18 J500.19 J500.20 J500.21 J501.15 J501.17 J501.23 R502.2 R503.2 R506.2 R507.2 R509.2 R511.2  [also labelled GND_Sensors]
GND_I: J500.22 J500.23 J501.1 J501.16 MTH500.1 MTH501.1
AN8: C501.1 D500.K R501.1 R503.1
AN9: C503.1 D501.K R505.1 R507.1
AN14: C500.1 D502.K R500.1 R502.1
AN14_filtered: J501.11 R500.2
AN15: C502.1 D503.K R504.1 R506.1
AN15_filtered: J501.3 R504.2
APPS_1: J500.6
APPS_2: J500.5
CAN1_H: J500.9
CAN1_L: J500.1
CAN2_H: J500.2
CAN2_L: J500.16
CAN3_H: J500.17
CAN3_L: J500.10
CAN4_H: J500.11
CAN4_L: J500.3
CurrentSensor: J501.21 R505.2 R512.1
GPIO_RB5: J501.12
GPIO_RB6: J501.19
GPIO_RB9: J501.22
GPIO_RC9: J501.5
GPIO_RD6: J501.13
INT1: C504.1 D504.K R508.1 R509.1
INT1_CON: J501.4 R508.2
INT3: C505.1 D505.K R510.1 R511.1
INT3_CON: J501.18 R510.2
MOSFET_A_(R2D)_IN: J501.7
MOSFET_B_IN: J501.8
OC12: J501.20
OC13: J501.6
OC14: J501.14
SCL4: IC500.3(SCL)
SDA4: IC500.4(SDA)
U3RX: J500.4
U3TX: J500.12
NetIC500_1: IC500.1(VIN+) R512.2

Not connected (* = marked no-connect by the designer): MTH502 1*

### Notes on the sheet
- ADCs
- (near R501) Voltage meter
- Connectors
- 2 * 23 pin connector
- (near R505) Current meter
- GREY
- @{"Id":"ZAMRUTGT\CNQWCZKK","ObjectType":1} VCU internal reference (used to read external analog sensores)
- GPIOS
- Mounting holes
- BLUE
- fazer circuito mosfets

### Library data of the parts
C500-C505 = CAP_0805_10V: Capacitor SMD 0805 10V
D500-D505 = D_SCHOTTKY_SOD_323: Diode Schottky SMD SOD-323
IC500 = MCP3421A0T-E_CH: Integrated Circuit; Manufacturer_Name: Microchip; Manufacturer_Part_Number: MCP3421A0T-E/CH; Datasheet Link: http://ww1.microchip.com/downloads/en/DeviceDoc/22003e.pdf; Height: 1.45mm; Mouser Part Number: 579-MCP3421A0T-E/CH; Mouser Price/Stock: https://www.mouser.co.uk/ProductDetail/Microchip-Technology/MCP3421A0T-E-CH?qs=hH%252BOa0VZEiAAD%252B%252BQL9ANdQ%3D%3D; Arrow Part Number: MCP3421A0T-E/CH; Arrow Price/Stock: https://www.arrow.com/en/products/mcp3421a0t-ech/microchip-technology?region=nac
J500 J501 = 1-776087-5: CONN HDR 23POS R/A W/GASKET AU
R500-R512 = RES_0805: Resistor SMD 0805; Manufacturer: *; Manufacturer Part Number: *; Distributor Link: *; LCSC: *

## Sheet MOSFETS.SchDoc
size A4; SheetNumber: 6; SheetTotal: 6
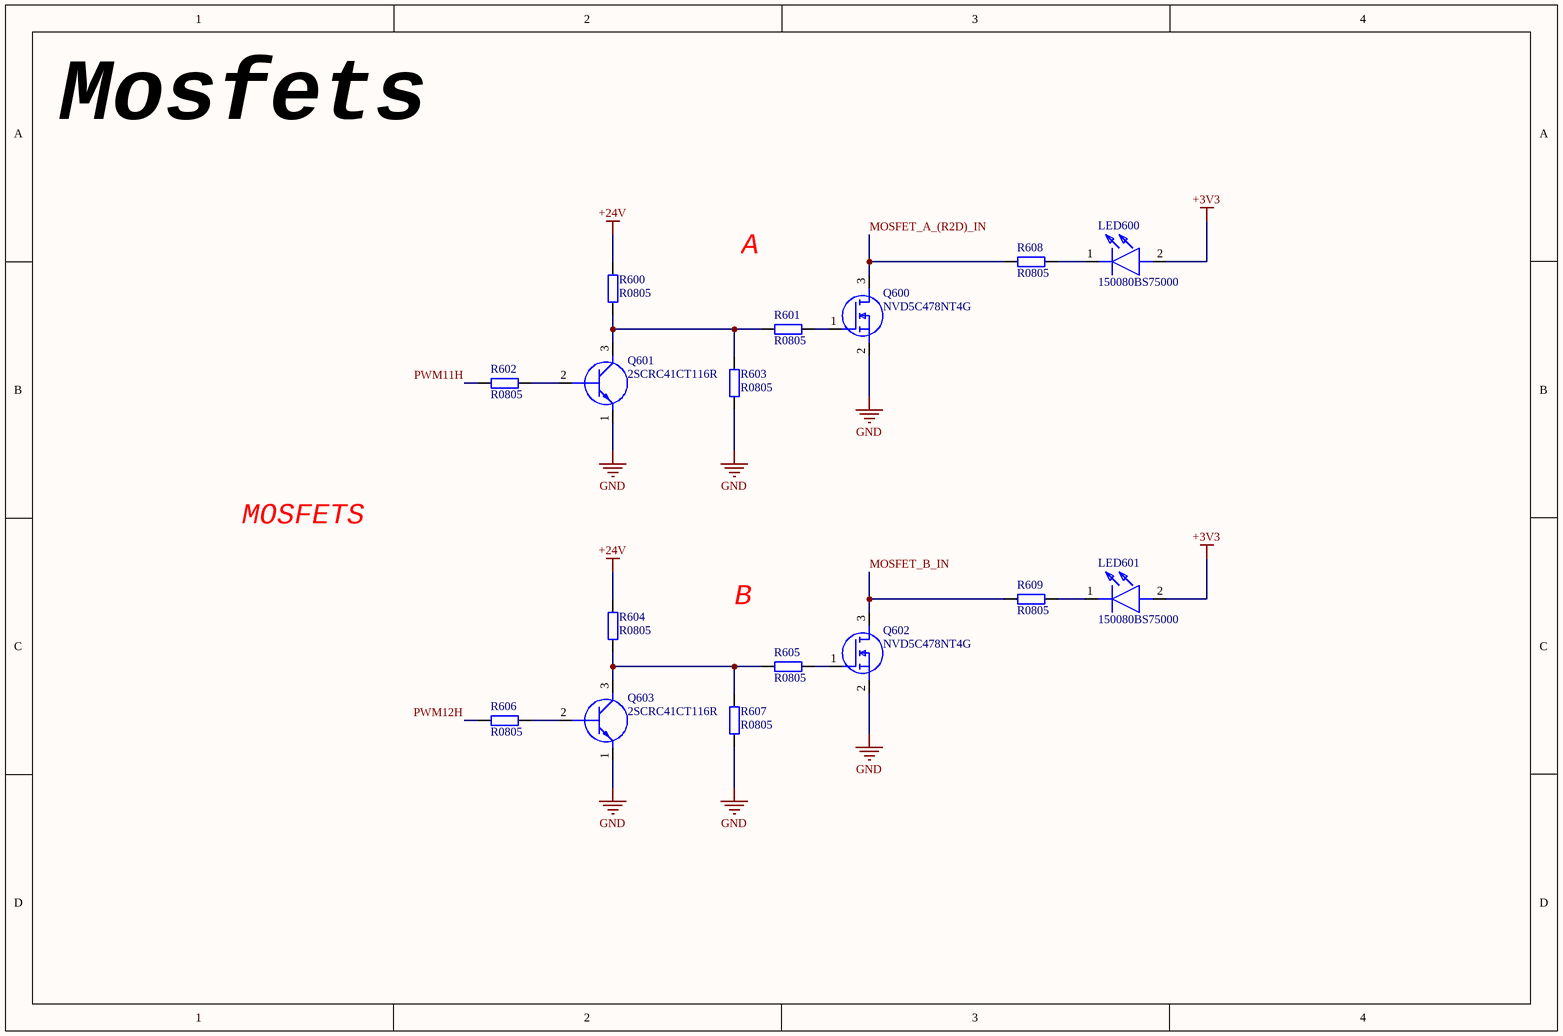
[diagram p6: MOSFETS.SchDoc]

### Parts
LED600  150080BS75000  [LEDC2012X80N]
LED601  150080BS75000  [LEDC2012X80N]
Q600  NVD5C478NT4G  [DPAK_(SINGLE-GAUGE)_TO-252(369C)_ISSUE_F]
Q601  2SCRC41CT116R  [SST2222AT116]
Q602  NVD5C478NT4G  [DPAK_(SINGLE-GAUGE)_TO-252(369C)_ISSUE_F]
Q603  2SCRC41CT116R  [SST2222AT116]
R600  R0805  [RES_0805]
R601  R0805  [RES_0805]
R602  R0805  [RES_0805]
R603  R0805  [RES_0805]
R604  R0805  [RES_0805]
R605  R0805  [RES_0805]
R606  R0805  [RES_0805]
R607  R0805  [RES_0805]
R608  R0805  [RES_0805]
R609  R0805  [RES_0805]

### Nets
+3V3: LED600.2(A) LED601.2(A)
+24V: R600.1 R604.1
GND: Q600.2(S) Q601.1(E) Q602.2(S) Q603.1(E) R603.2 R607.2
MOSFET_A_(R2D)_IN: Q600.3(D) R608.1
MOSFET_B_IN: Q602.3(D) R609.1
PWM11H: R602.1
PWM12H: R606.1
NetLED600_1: LED600.1(K) R608.2
NetLED601_1: LED601.1(K) R609.2
NetQ600_1: Q600.1(G) R601.2
NetQ601_2: Q601.2(B) R602.2
NetQ601_3: Q601.3(C) R600.2 R601.1 R603.1
NetQ602_1: Q602.1(G) R605.2
NetQ603_2: Q603.2(B) R606.2
NetQ603_3: Q603.3(C) R604.2 R605.1 R607.1

### Notes on the sheet
- Mosfets
- A
- MOSFETS
- B

### Library data of the parts
LED600 LED601 = 150080BS75000: LED; Manufacturer_Name: Wurth Elektronik; Datasheet Link: https://katalog.we-online.com/led/datasheet/150080BS75000.pdf; Height: 0.8mm; Manufacturer_Part_Number: 150080BS75000; Mouser Part Number: 710-150080BS75000; Mouser Price/Stock: https://www.mouser.co.uk/ProductDetail/Wurth-Elektronik/150080BS75000?qs=2kOmHSv6VfT2tBo3UPVqAQ%3D%3D
Q600 Q602 = NVD5C478NT4G: MOSFET (N-Channel); Manufacturer_Name: onsemi; Datasheet Link: http://www.onsemi.com/pub/Collateral/NVD5C478N-D.PDF; Manufacturer_Part_Number: NVD5C478NT4G; Mouser Part Number: 863-NVD5C478NT4G; Mouser Price/Stock: https://www.mouser.co.uk/ProductDetail/ON-Semiconductor/NVD5C478NT4G/?qs=y6ZabgHbY%252Bxvq0EyOcHTlg%3D%3D; Arrow Part Number: NVD5C478NT4G; Arrow Price/Stock: https://www.arrow.com/en/products/nvd5c478nt4g/on-semiconductor?region=nac
Q601 Q603 = 2SCRC41CT116R: Transistor BJT NPN; Manufacturer_Name: ROHM Semiconductor; Datasheet Link: https://datasheet.datasheetarchive.com/originals/distributors/Datasheets_SAMA/953df4fe31d6a1f75743e1da8a6d7a5d.pdf; Manufacturer_Part_Number: 2SCRC41CT116R; Mouser Part Number: 755-2SCRC41CT116; Mouser Price/Stock: https://www.mouser.co.uk/ProductDetail/ROHM-Semiconductor/2SCRC41CT116R?qs=BJlw7L4Cy7%252BOqTjwpUJKrw%3D%3D
R600-R609 = RES_0805: Resistor SMD 0805; Manufacturer: *; Manufacturer Part Number: *; Distributor Link: *; LCSC: *

## Nets that join several sheets
+3V3: POWER (C111.1 PS101.3 TP104.1), PIC32 (19 pins), CAN (8 pins), OUTPUT (IC500.5 J500.7 J501.10), MOSFETS (LED600.2 LED601.2)
+5V: POWER (7 pins), PIC32 (D200.K IC201.1 R205.1 T200.2), CAN (8 pins), APPS (C401.2 IC400.8), OUTPUT (J500.15 J501.2)
+5V_APPS_1: POWER (C107.1 IC100.3 TP102.1), OUTPUT (J500.14)
+5V_APPS_2: POWER (C109.1 IC101.3 TP103.1), OUTPUT (J500.13)
+24V: POWER (6 pins), OUTPUT (R501.2), MOSFETS (R600.1 R604.1)
+24VPDM: POWER (F100.1), OUTPUT (J500.8 J501.9)
GND: POWER (23 pins), PIC32 (39 pins), CAN (36 pins), APPS (10 pins), OUTPUT (27 pins), MOSFETS (6 pins)
GND_I: POWER (L101.1), OUTPUT (6 pins)
AN0-APPS1: PIC32 (IC200.13), APPS (R400.2 R405.1 TP400.1)
AN4-APPS2: PIC32 (IC200.16), APPS (R401.1 R406.1 TP401.1)
AN8: PIC32 (IC200.23), OUTPUT (C501.1 D500.K R501.1 R503.1)
AN9: PIC32 (IC200.12), OUTPUT (C503.1 D501.K R505.1 R507.1)
AN14: PIC32 (IC200.29), OUTPUT (C500.1 D502.K R500.1 R502.1)
AN15: PIC32 (IC200.30), OUTPUT (C502.1 D503.K R504.1 R506.1)
APPS_1: APPS (R402.1 R404.2 TP402.1), OUTPUT (J500.6)
APPS_2: APPS (R403.2 R407.2 TP403.1), OUTPUT (J500.5)
CAN1_H: CAN (C300.2 D300.1 FL300.3 R300.2), OUTPUT (J500.9)
CAN1_L: CAN (C308.1 D302.2 FL300.2 R302.1), OUTPUT (J500.1)
CAN2_H: CAN (C301.2 D301.1 FL301.3 R301.2), OUTPUT (J500.2)
CAN2_L: CAN (C309.1 D303.2 FL301.2 R303.1), OUTPUT (J500.16)
CAN3_H: CAN (C310.2 D304.1 FL302.3 R304.2), OUTPUT (J500.17)
CAN3_L: CAN (C318.1 D306.2 FL302.2 R306.1), OUTPUT (J500.10)
CAN4_H: CAN (C311.2 D305.1 FL303.3 R305.2), OUTPUT (J500.11)
CAN4_L: CAN (C319.1 D307.2 FL303.2 R307.1), OUTPUT (J500.3)
GPIO_RB5: PIC32 (IC200.43), OUTPUT (J501.12)
GPIO_RB6: PIC32 (IC200.44), OUTPUT (J501.19)
GPIO_RB9: PIC32 (IC200.49), OUTPUT (J501.22)
GPIO_RC9: PIC32 (IC200.55), OUTPUT (J501.5)
GPIO_RD6: PIC32 (IC200.54), OUTPUT (J501.13)
INT1: PIC32 (IC200.8), OUTPUT (C504.1 D504.K R508.1 R509.1)
INT3: PIC32 (IC200.31), OUTPUT (C505.1 D505.K R510.1 R511.1)
MOSFET_A_(R2D)_IN: OUTPUT (J501.7), MOSFETS (Q600.3 R608.1)
MOSFET_B_IN: OUTPUT (J501.8), MOSFETS (Q602.3 R609.1)
OC12: PIC32 (IC200.52), OUTPUT (J501.20)
OC13: PIC32 (IC200.51), OUTPUT (J501.6)
OC14: PIC32 (IC200.50), OUTPUT (J501.14)
PWM11H: PIC32 (IC200.58), MOSFETS (R602.1)
PWM12H: PIC32 (IC200.53), MOSFETS (R606.1)
RX_CAN_1: PIC32 (IC200.1), CAN (IC300.4)
RX_CAN_2: PIC32 (IC200.5), CAN (IC301.4)
RX_CAN_3: PIC32 (IC200.4), CAN (IC302.4)
RX_CAN_4: PIC32 (IC200.15), CAN (IC303.4)
SCL4: PIC32 (IC200.28 R212.2 T201.3), OUTPUT (IC500.3)
SDA4: PIC32 (IC200.27 R213.2 T201.4), OUTPUT (IC500.4)
TX_CAN_1: PIC32 (IC200.3), CAN (IC300.1)
TX_CAN_2: PIC32 (IC200.2), CAN (IC301.1)
TX_CAN_3: PIC32 (IC200.6), CAN (IC302.1)
TX_CAN_4: PIC32 (IC200.14), CAN (IC303.1)
U3RX: PIC32 (R211.2), OUTPUT (J500.4)
U3TX: PIC32 (R209.2), OUTPUT (J500.12)